# EAGLE design seven_seg_thermistor_one (EAGLE 6.0)
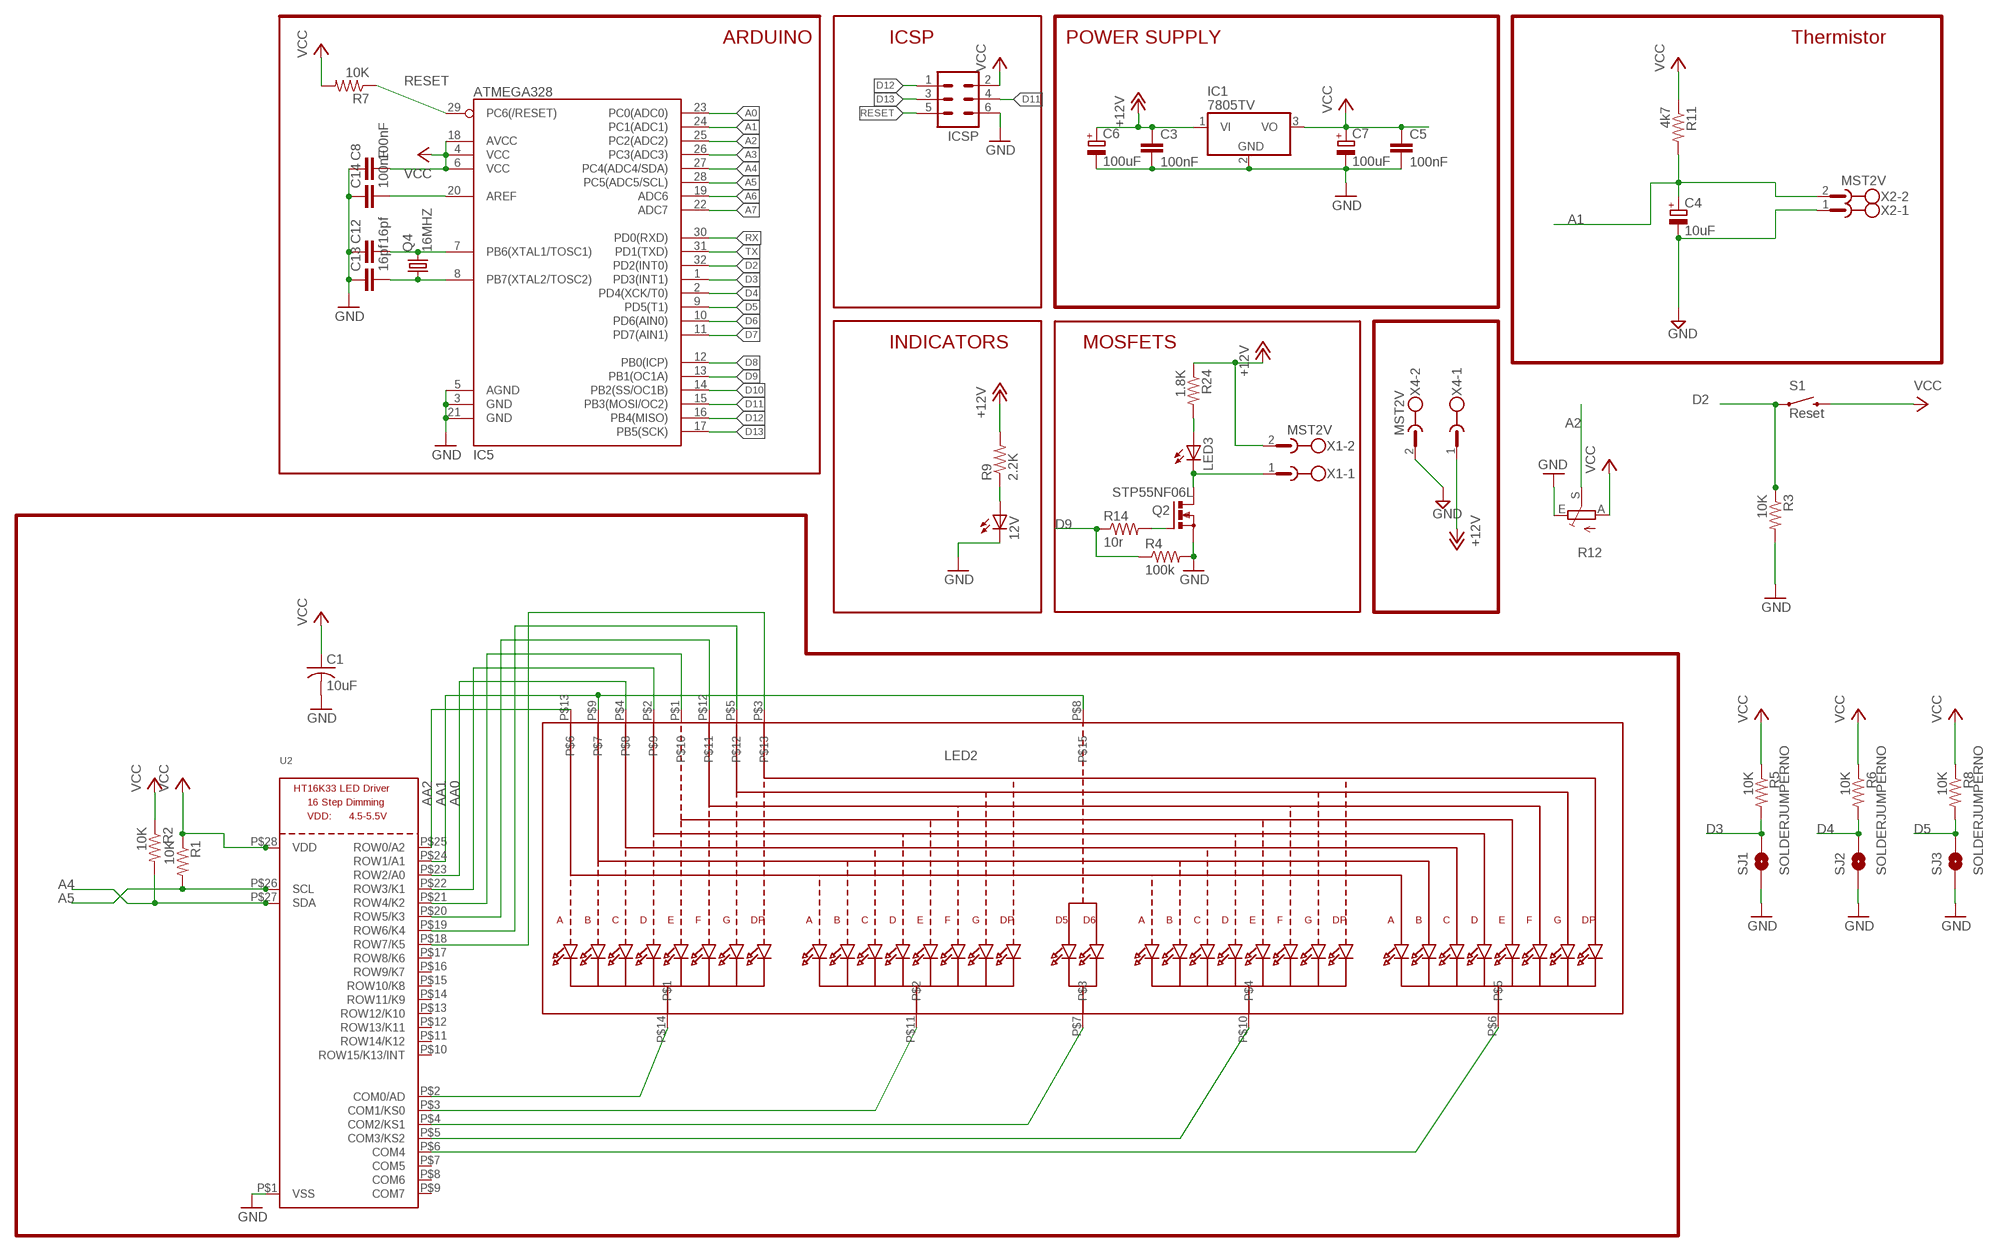
[diagram p0: schematic, sheet 1]

## Parts
12V  LED0805  [LED-0805]
C1  10uF  C-USC0805K  [C0805K]
C3  100nF  CAP0805  [0805]
C4  10uF  CPOL-EUE5-6  [E5-6]
C5  100nF  CAP0805  [0805]
C6  100uF  CPOL-EUE3.5-8  [E3,5-8]
C7  100uF  CPOL-EUE3.5-8  [E3,5-8]
C8  100nF  CAP0805  [0805]
C12  16pf  CAP0805  [0805]
C13  16pf  CAP0805  [0805]
C14  100nF  CAP0805  [0805]
IC1  7805TV  [TO220V]
IC5  ATMEGA328  ATMEGA168  [TQFP32-08]
ICSP  ML6  [ML6]
LED2  DISP_SEGMENT_4DIGIT_BL-Q56C43  [SEGMENT-BL-Q56C43]
LED3  LEDCHIP-LED0805  [CHIP-LED0805]
Q2  STP55NF06L  IRF512  [TO220BV]
Q4  16MHZ  CRYSTALHC49S  [HC49/S]
R1  10K  R-US_R0805  [R0805]
R2  10K  R-US_R0805  [R0805]
R3  10K  RESISTOR  [0805]
R4  100k  R-US_R0805  [R0805]
R5  10K  RESISTOR  [0805]
R6  10K  RESISTOR  [0805]
R7  10K  RESISTOR  [0805]
R8  10K  RESISTOR  [0805]
R9  2.2K  RESISTOR  [0805]
R11  4k7  RESISTOR  [0805]
R12  TRIM_EU-B25U  [B25U]
R14  10r  R-US_M0805  [M0805]
R24  1.8K  R-US_R0805  [R0805]
S1  Reset  SWITCH-MOMENTARY-2SMD-ALT01  [TACTILE-SWITCH-SMD-ALT01]
SJ1  SOLDERJUMPERNO  [SJ_2S-NO]
SJ2  SOLDERJUMPERNO  [SJ_2S-NO]
SJ3  SOLDERJUMPERNO  [SJ_2S-NO]
U2  HT16K33_SOP28  [SOP28_300MIL]
X1  MST2V  [MSTBV2]
X2  MST2V  [MSTBV2]
X4  MST2V  [MSTBV2]

## Nets
+12V [motors]: C3.1 C6.+ IC1.1(VI) R9.2 R24.1 X1.2 X4.1
A0: IC5.23(PC0(ADC0))
A1: C4.+ IC5.24(PC1(ADC1)) R11.2 X2.2
A2: IC5.25(PC2(ADC2)) R12.S
A3: IC5.26(PC3(ADC3))
A4: IC5.27(PC4(ADC4/SDA)) R2.2 U2.P$27(SDA)
A5: IC5.28(PC5(ADC5/SCL)) R1.2 U2.P$26(SCL)
A6: IC5.19(ADC6)
A7: IC5.22(ADC7)
AA0: LED2.P$4 U2.P$23(ROW2/A0)
AA1: LED2.P$8 LED2.P$9 U2.P$24(ROW1/A1)
AA2: LED2.P$13 U2.P$25(ROW0/A2)
D2: IC5.32(PD2(INT0)) R3.1 S1.1 S1.2
D3: IC5.1(PD3(INT1)) R5.2 SJ1.2
D4: IC5.2(PD4(XCK/T0)) R6.2 SJ2.2
D5: IC5.9(PD5(T1)) R8.2 SJ3.2
D6: IC5.10(PD6(AIN0))
D7: IC5.11(PD7(AIN1))
D8: IC5.12(PB0(ICP))
D9: IC5.13(PB1(OC1A)) R4.1 R14.1
D10: IC5.14(PB2(SS/OC1B))
D11: IC5.15(PB3(MOSI/OC2)) ICSP.4
D12: IC5.16(PB4(MISO)) ICSP.1
D13: IC5.17(PB5(SCK)) ICSP.3
GND [motors]: 12V.C C1.2 C3.2 C4.- C5.2 C6.- C7.- C8.1 C12.1 C13.1 C14.1 IC1.2(GND) IC5.3(GND) IC5.5(AGND) IC5.21(GND) ICSP.6 Q2.S R3.2 R4.2 R12.E SJ1.1 SJ2.1 SJ3.1 U2.P$1(VSS) X2.1 X4.2
N$2: LED2.P$14 U2.P$2(COM0/AD)
N$3: LED2.P$11 U2.P$3(COM1/KS0)
N$4: LED2.P$7 U2.P$4(COM2/KS1)
N$5: LED2.P$10 U2.P$5(COM3/KS2)
N$6: LED2.P$6 U2.P$6(COM4)
N$7 [motors]: LED3.C Q2.D X1.1
N$10: LED2.P$2 U2.P$22(ROW3/K1)
N$11: LED2.P$1 U2.P$21(ROW4/K2)
N$12: LED2.P$12 U2.P$20(ROW5/K3)
N$13: LED2.P$5 U2.P$19(ROW6/K4)
N$16: LED2.P$3 U2.P$18(ROW7/K5)
N$20: C14.2 IC5.20(AREF)
N$26: 12V.A R9.1
N$31: C12.2 IC5.7(PB6(XTAL1/TOSC1)) Q4.2
N$32: C13.2 IC5.8(PB7(XTAL2/TOSC2)) Q4.1
N$45: LED3.A R24.2
N$47: Q2.G R14.2
RESET: IC5.29(PC6(/RESET)) ICSP.5 R7.1
RX: IC5.30(PD0(RXD))
TX: IC5.31(PD1(TXD))
VCC: C1.1 C5.1 C7.+ C8.2 IC1.3(VO) IC5.4(VCC) IC5.6(VCC) IC5.18(AVCC) ICSP.2 R1.1 R2.1 R5.1 R6.1 R7.2 R8.1 R11.1 R12.A S1.3 S1.4 U2.P$28(VDD)
Unconnected: U2.P$7(COM5) U2.P$8(COM6) U2.P$9(COM7) U2.P$10(ROW15/K13/INT) U2.P$11(ROW14/K12) U2.P$12(ROW13/K11) U2.P$13(ROW12/K10) U2.P$14(ROW11/K9) U2.P$15(ROW10/K8) U2.P$16(ROW9/K7) U2.P$17(ROW8/K6)

## Notes on the sheet
- ARDUINO | ICSP | POWER SUPPLY | Thermistor
- INDICATORS | MOSFETS

## Library data of the parts
12V = SparkFun:LED: LEDs Standard schematic elements and footprints for 5mm, 3mm, 1206, and 0603 sized LEDs. 5mm - Spark Fun Electronics SKU : COM-00529 (and others)
C1 = adafruit:C-US: CAPACITOR, American symbol
C3 C5 C8 C12-C14 = SparkFun:CAP: Capacitor Standard 0603 ceramic capacitor, and 0.1" leaded capacitor.
C4 C6 C7 = rcl:CPOL-EU: POLARIZED CAPACITOR, European symbol
IC1 = linear:78*: Positive VOLTAGE REGULATOR Source: http://cache.national.com/ds/LM/LM78L05.pdf http://www.fairchildsemi.com/ds/LM/LM7805.pdf
IC5 = SparkFun:ATMEGA168
ICSP = con-harting-ml:ML6: HARTING
LED2 = microbuilder:DISP_SEGMENT_4DIGIT_BL-Q56C43
LED3 = led:LED: LED OSRAM: - CHIPLED LG R971, LG N971, LY N971, LG Q971, LY Q971, LO R971, LY R971 LH N974, LH R974 LS Q976, LO Q976, LY Q976 LO Q996 - Hyper CHIPLED LW Q18S LB Q993, LB Q99A, LB R99A - SideLED LS A670, LO A670, LY A670, LG A670, LP A670 LB A673, LV A673, LT A673, LW A673 LH A674 LY A675 LS A676, LA A676, LO A676, LY A676, LW A676 LS A679, LY A679, LG A679 - Hyper Micro SIDELED® LS Y876, LA Y876, LO Y876, LY Y876 LT Y87S - SmartLED LW L88C, LW L88S LB L89C, LB L89S, LG L890 LS L89K, LO L89K, LY L89K LS L896, LA L896, LO L896, LY L896 - TOPLED LS T670, LO T670, LY T670, LG T670, LP T670 LSG T670, LSP T670, LSY T670, LOP T670, LYG T670 LG T671, LOG T671, LSG T671 LB T673, LV T673, LT T673, LW T673 LH T674 LS T676, LA T676, LO T676, LY T676, LB T676, LH T676, LSB T676, LW T676 LB T67C, LV T67C, LT T67C, LS T67K, LO T67K, LY T67K, LW E67C LS E67B, LA E67B, LO E67B, LY E67B, LB E67C, LV E67C, LT E67C LW T67C LS T679, LY T679, LG T679 LS T770, LO T770, LY T770, LG T770, LP T770 LB T773, LV T773, LT T773, LW T773 LH T774 LS E675, LA E675, LY E675, LS T675 LS T776, LA T776, LO T776, LY T776, LB T776 LHGB T686 LT T68C, LB T68C - Hyper Mini TOPLED® LB M676 - Mini TOPLED Santana® LG M470 LS M47K, LO M47K, LY M47K Source: http://www.osram.convergy.de LUXEON: - LUMILED® LXK2-PW12-R00, LXK2-PW12-S00, LXK2-PW14-U00, LXK2-PW14-V00 LXK2-PM12-R00, LXK2-PM12-S00, LXK2-PM14-U00 LXK2-PE12-Q00, LXK2-PE12-R00, LXK2-PE12-S00, LXK2-PE14-T00, LXK2-PE14-U00 LXK2-PB12-K00, LXK2-PB12-L00, LXK2-PB12-M00, LXK2-PB14-N00, LXK2-PB14-P00, LXK2-PB14-Q00 LXK2-PR12-L00, LXK2-PR12-M00, LXK2-PR14-Q00, LXK2-PR14-R00 LXK2-PD12-Q00, LXK2-PD12-R00, LXK2-PD12-S00 LXK2-PH12-R00, LXK2-PH12-S00 LXK2-PL12-P00, LXK2-PL12-Q00, LXK2-PL12-R00 Source: www.luxeon.com KINGBRIGHT: KA-3528ASYC Source: www.kingbright.com
Q2 = transistor-power:IRF512: N-CHANNEL MOS FET
Q4 = crystal:CRYSTAL: CRYSTAL
R1 R2 R4 R24 = adafruit:R-US_: RESISTOR, American symbol
R3 R5-R9 R11 = SparkFun:RESISTOR: Resistor Basic schematic elements and footprints for 0603, 1206, and PTH 1/10th watt (small) resistors.
R12 = pot:TRIM_EU-: POTENTIOMETER
R14 = resistor:R-US_: RESISTOR, American symbol
S1 = Testing:SWITCH-MOMENTARY-2: Various NO switches- pushbuttons, reed, etc
SJ1-SJ3 = SparkFun-Retired:SOLDERJUMPER: Solder Jumper Standard SMD solder jumper. Used to automate production. Two varients : Normally Open and Normally Closed are the same, but have different paste layers. NC will have a large amount of paste and should jumper during reflow.
U2 = microbuilder:HT16K33_SOP28
X1 X2 X4 = con-phoenix-508:MST2V: PHOENIX

## Net classes
1 vcc: width 0.254 mm
2 motors: width 1.016 mm

## Board
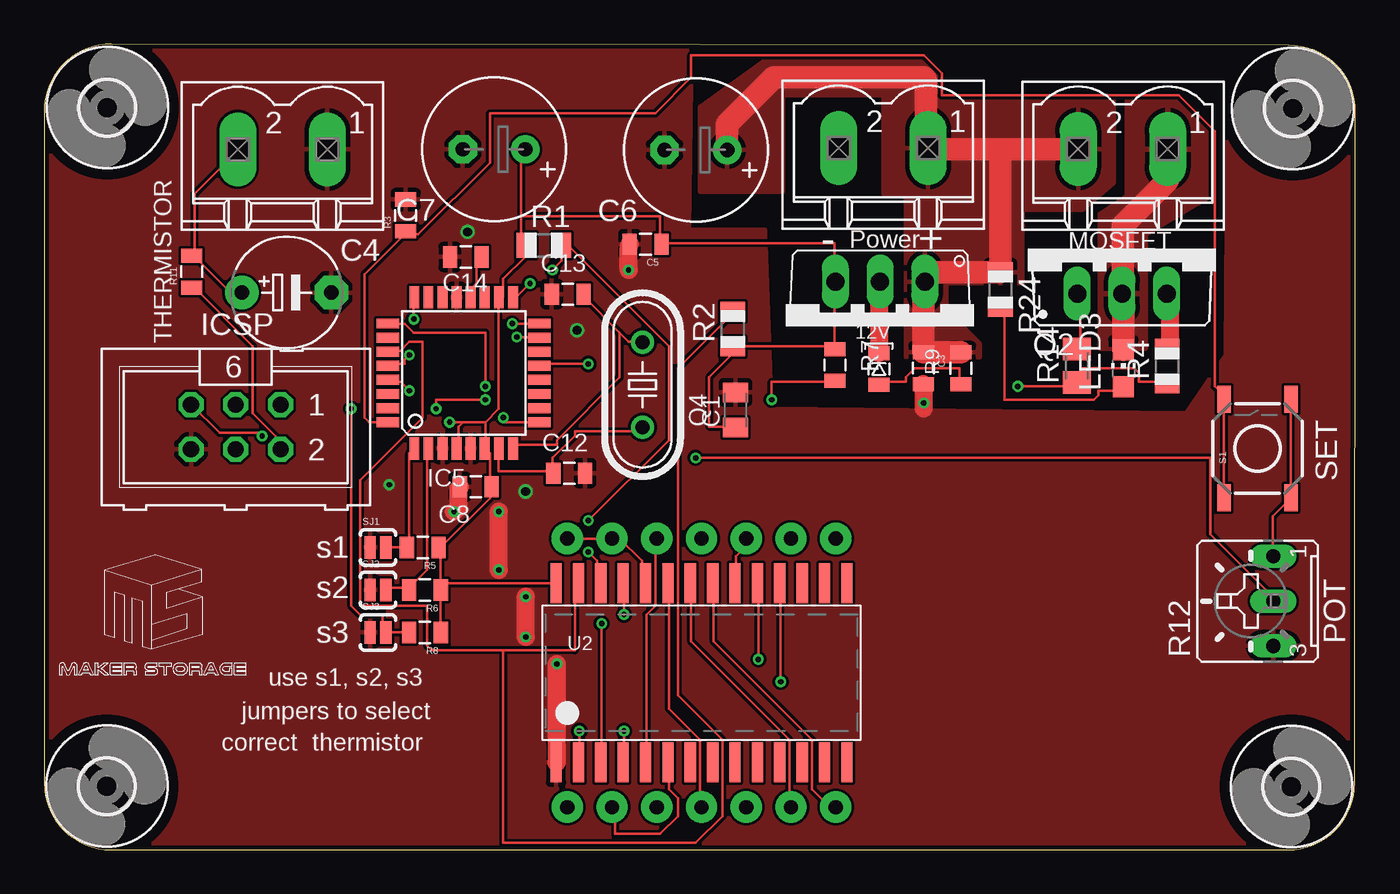
[diagram p1: board, top side]
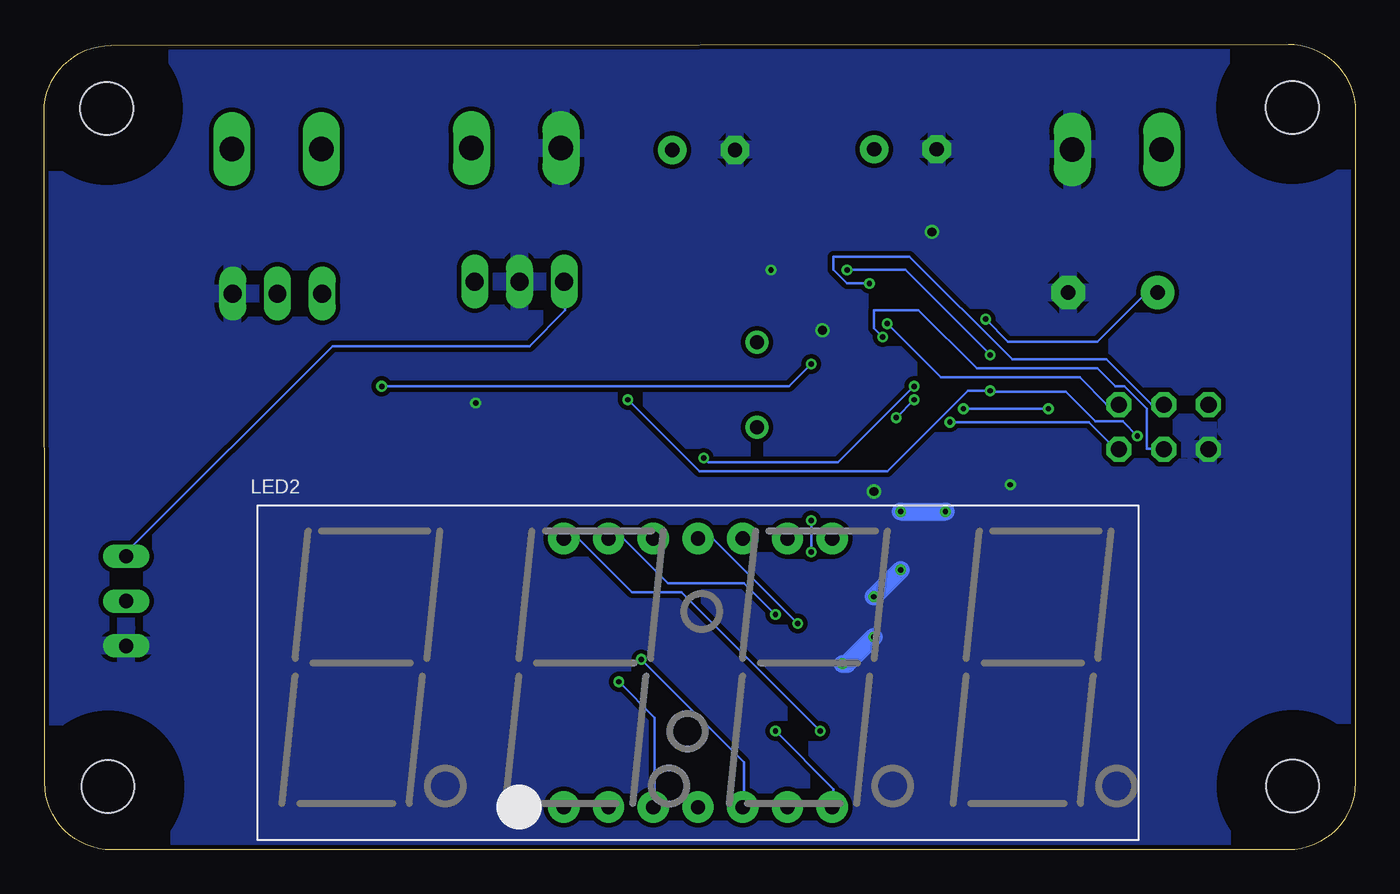
[diagram p2: board, bottom side, seen from below]

Size 74.45 x 45.73 mm. Coordinates in mm from the lower left corner, seen from the top.
Outline: 0,41.92 0.01,3.82 arc90 3.82,0 70.6,0 arc90 74.41,3.81 74.45,41.85 arc90 70.64,45.66 3.81,45.73 arc90 0,41.92
Copper layers (1*16): Top 0.035mm / dielectric 1.5mm / Bottom 0.035mm
Design rules: minimum track width 6mil, minimum drill 12mil, track to track 6mil, track to pad 6mil, pad to pad 6mil, via to via 6mil, smd to smd 0mil, copper to edge 10mil, drill to drill 10mil, minimum pad ring 10mil, minimum via ring 6mil, stop-mask expansion 2mil, vias tented up to drill 100mil, thermal gap 10mil

### Footprints (pad centres in the part's own frame; a part is rotated, then mirrored left to right if it is on the bottom)
LED-0805 = smd 1.2 x 0.8: A 0,-0.9; C 0,0.9
C0805K = smd 1.1 x 1.4: 1 -1,0; 2 1,0
0805 = smd 0.8 x 1.2: 1 -0.9,0; 2 0.9,0
E5-6 = drill 0.813 pad 1.905: + -2.54,0 | drill 0.813 pad 1.905 octagon: - 2.54,0
E3,5-8 = drill 0.813 pad 1.6: + -1.778,0 | drill 0.813 pad 1.6 octagon: - 1.778,0
TO220V = drill 1.016 long: 1 -2.54,-2.54; 2 0,-2.54; 3 2.54,-2.54
TQFP32-08 = smd 1.27 x 0.559: 1 -4.293,2.8; 2 -4.293,2; 3 -4.293,1.2; 4 -4.293,0.4; 5 -4.293,-0.4; 6 -4.293,-1.2; 7 -4.293,-2; 8 -4.293,-2.8; 17 4.293,-2.8; 18 4.293,-2; 19 4.293,-1.2; 20 4.293,-0.4; 21 4.293,0.4; 22 4.293,1.2; 23 4.293,2; 24 4.293,2.8 | smd 0.559 x 1.27: 9 -2.8,-4.293; 10 -2,-4.293; 11 -1.2,-4.293; 12 -0.4,-4.293; 13 0.4,-4.293; 14 1.2,-4.293; 15 2,-4.293; 16 2.8,-4.293; 25 2.8,4.293; 26 2,4.293; 27 1.2,4.293; 28 0.4,4.293; 29 -0.4,4.293; 30 -1.2,4.293; 31 -2,4.293; 32 -2.8,4.293
ML6 = drill 0.914 octagon: 1 -2.54,-1.27; 2 -2.54,1.27; 3 0,-1.27; 4 0,1.27; 5 2.54,-1.27; 6 2.54,1.27
SEGMENT-BL-Q56C43 = drill 0.8 pad 1.778: P$1 -7.62,-7.62; P$2 -5.08,-7.62; P$3 -2.54,-7.62; P$4 0,-7.62; P$5 2.54,-7.62; P$6 5.08,-7.62; P$7 7.62,-7.62; P$8 7.62,7.62; P$9 5.08,7.62; P$10 2.54,7.62; P$11 0,7.62; P$12 -2.54,7.62; P$13 -5.08,7.62; P$14 -7.62,7.62
CHIP-LED0805 = smd 1.2 x 1.2: A 0,-1.05; C 0,1.05
TO220BV = drill 1.016 long: D 0,-2.54; G -2.54,-2.54; S 2.54,-2.54
HC49/S = drill 0.813: 1 -2.413,0; 2 2.413,0
R0805 = smd 1.1 x 1.4: 1 -1,0; 2 1,0
B25U = drill 0.813 long: A 2.54,-0.889; E -2.54,-0.889; S 0,-0.889
M0805 = smd 1.3 x 1.6: 1 -0.95,0; 2 0.95,0
TACTILE-SWITCH-SMD-ALT01 = smd 1.524 x 0.762: 1 -2.794,1.905; 2 2.794,1.905; 3 -2.794,-1.905; 4 2.794,-1.905
SJ_2S-NO = smd 0.635 x 1.27: 1 -0.45,0; 2 0.45,0
SOP28_300MIL = smd 0.635 x 2.286: P$1 -8.255,-5.08; P$2 -6.985,-5.08; P$3 -5.715,-5.08; P$4 -4.445,-5.08; P$5 -3.175,-5.08; P$6 -1.905,-5.08; P$7 -0.635,-5.08; P$8 0.635,-5.08; P$9 1.905,-5.08; P$10 3.175,-5.08; P$11 4.445,-5.08; P$12 5.715,-5.08; P$13 6.985,-5.08; P$14 8.255,-5.08; P$15 8.255,5.08; P$16 6.985,5.08; P$17 5.715,5.08; P$18 4.445,5.08; P$19 3.175,5.08; P$20 1.905,5.08; P$21 0.635,5.08; P$22 -0.635,5.08; P$23 -1.905,5.08; P$24 -3.175,5.08; P$25 -4.445,5.08; P$26 -5.715,5.08; P$27 -6.985,5.08; P$28 -8.255,5.08
3,0 = hole 3: 0,0
MSTBV2 = drill 1.397 long: 1 -2.54,0; 2 2.54,0

### Placement (x,y rotation side)
12V  47.39,27.29 0 top
C1  39.25,24.96 90 top
C3  49.92,27.33 270 top
C4  13.77,31.63 0 top
C5  34.14,34.37 180 top
C6  37.01,39.72 180 top
C7  25.55,39.75 180 top
C8  24.5,20.6 0 top
C12  29.81,21.38 180 top
C13  29.72,31.53 0 top
C14  23.94,33.65 0 top
IC1  47.46,29.7 180 top
IC5  23.82,27.07 90 top
ICSP  10.88,23.99 180 top
LED2  37.32,10.05 0 bottom
LED3  61.27,27.32 0 top
Q2  61.2,34.1 0 top
Q4  33.98,26.4 270 top
R1  28.38,34.31 0 top
R2  39.1,29.56 90 top
R3  20.53,36.01 90 top
R4  63.76,27.45 90 top
R5  21.5,17.16 180 top
R6  21.63,14.75 180 top
R7  44.89,27.51 90 top
R8  21.63,12.33 180 top
R9  52.05,27.33 90 top
R11  8.37,32.81 90 top
R12  68.89,14.12 90 top
R14  58.63,27.47 90 top
R24  54.29,31.79 270 top
S1  68.89,22.77 90 top
SJ1  18.96,17.16 0 top
SJ2  18.96,14.75 0 top
SJ3  18.96,12.33 0 top
U2  37.32,10.05 0 top
U$1  [3,0]  3.56,3.62 0 top
U$2  [3,0]  70.89,42.07 0 top
U$3  [3,0]  3.59,42.12 0 top
U$4  [3,0]  70.81,3.59 0 top
X1  61.25,39.77 180 top
X2  13.54,39.75 180 top
X4  47.64,39.83 180 top

### Tracks (layer width: path | path; a pad name or v marks a point on that pad's centre or on a via)
+12V
  Top 1.27: X1.2 54.52,39.77 | 54.52,39.77 50.24,39.77 X4.1 50.07,39.94 50.07,43.7 49.95,43.83 41.44,43.83 38.78,41.18 C6.+ | 54.52,39.77 54.29,39.54 R24.1 50.55,32.79 IC1.1 49.92,32.16 C3.1 R9.2
  pour Top: 60.74,45.1 60.74,37.86 58.96,36.34 55.53,36.34 55.53,32.15 51.22,32.15 51.22,30.62 53.12,28.72 53.12,27.96 48.93,27.96 48.93,37.23 47.66,37.23 47.66,42.81 41.95,42.81 41.95,37.35 37.25,37.35 37.25,42.18 41.31,45.1
A1  (via drill 0.3)
  Top 0.152: C4.+ 11.08,31.64 10.58,31.64 8.54,33.67 R11.2 8.54,33.92 8.54,37.23 10.83,39.51 X2.2 | v20.99,30.11 20.99,31.13 IC5.24
  Bottom 0.152: v20.99,30.11 19.72,28.84 14.64,28.84 12.1,31.38 11.34,31.38 C4.+
A2  (via drill 0.3)
  Top 0.152: v25.05,26.3 25.05,29.35 20.99,29.35 20.48,29.86 19.72,29.86 IC5.25 | v36.99,22.24 66.2,22.24 66.2,17.92 69.76,14.37 R12.S
  Bottom 0.152: v25.05,26.3 29.37,21.99 36.74,21.99 v36.99,22.24
A4
  Top 0.152: 26.07,11.32 30.13,11.32 30.13,15.13 U2.P$27 | 26.07,11.32 22.01,11.32 21.75,11.57 21.75,13.86 17.94,13.86 17.94,20.97 21.5,24.53 21.5,28.84 20.74,28.84 20.23,28.34 19.72,28.34 IC5.27 | 26.07,11.32 26.07,0.4 36.99,0.4 38.52,1.92 38.52,6.24 35.98,8.78 35.98,27.32 39.02,30.37 R2.2
A5  (via drill 0.3)
  Top 0.152: v20.74,28.08 20.48,27.83 20.48,27.57 19.72,27.57 IC5.28 | v28.86,32.91 29.37,33.42 29.37,34.18 R1.2 29.63,34.43 35.47,28.59 35.47,23.26 v30.9,18.68 | v30.9,16.91 31.4,16.4 31.4,15.13 U2.P$26
  Bottom 0.152: v20.74,28.08 25.56,32.91 v28.86,32.91 | v30.9,18.68 v30.9,16.91
AA0
  Top 0.152: U2.P$23 35.47,15.13 35.47,8.02 37.25,6.24 37.25,2.43 LED2.P$4
AA1
  Top 0.152: U2.P$24 33.94,15.13 33.94,16.4 32.67,17.67 LED2.P$9 LED2.P$8
AA2  (via drill 0.3)
  Top 0.152: v32.93,13.35 32.93,15.13 U2.P$25
  Bottom 0.152: v32.93,13.35 34.71,15.13 39.02,15.13 41.56,17.67 LED2.P$13
D2
  Top 0.152: S1.1 66.96,20.21 66.96,25.54 S1.2 66.96,25.8 66.46,26.3 66.46,40.78 64.42,42.81 50.96,42.81 50.96,44.08 49.95,45.1 36.74,45.1 36.74,43.83 34.71,41.8 25.31,41.8 25.31,39 21.24,34.94 20.74,34.94 R3.1 20.48,34.94 18.2,32.65 18.2,24.53 18.45,24.27 19.47,24.27 IC5.32
D3
  Top 0.152: SJ1.2 R5.2 20.74,17.16 20.74,22.49 IC5.1
D4
  Top 0.152: SJ2.2 19.47,14.87 20.48,14.87 R6.2 20.74,14.87 21.75,15.89 21.75,22.75 IC5.2
D5  (via drill 0.3)
  Top 0.152: R8.2 SJ3.2 19.21,12.33 19.21,13.35 17.94,13.35 17.43,13.86 v17.43,25.03 | v26.07,24.53 26.07,24.27 IC5.9 | v25.05,25.54 22.26,25.54 v22.26,25.03
  Bottom 0.152: v25.05,25.54 v26.07,24.53 | v17.43,25.03 v22.26,25.03
D9  (via drill 0.3)
  Top 0.152: v30.9,27.57 28.36,27.57 IC5.13 | v55.28,26.3 58.58,26.3 R14.1 58.84,26.56 58.84,27.32 61.88,27.32 62.14,27.07 62.14,26.56 63.66,26.56 R4.1
  Bottom 0.152: v30.9,27.57 32.17,26.3 v55.28,26.3
D11  (via drill 0.3)
  Top 0.152: v26.83,29.1 28.1,29.1 IC5.15
  Bottom 0.152: v26.83,29.1 27.34,29.61 27.34,30.62 24.8,30.62 21.5,27.32 14.64,27.32 13.62,26.3 13.12,26.3 11.85,25.03 11.85,22.75 11.08,22.75 ICSP.4
D12  (via drill 0.3)
  Top 0.152: v26.58,29.86 IC5.16
  Bottom 0.152: v26.58,29.86 23.53,26.81 15.66,26.81 14.13,25.29 13.62,25.29 ICSP.1
D13  (via drill 0.3)
  Top 0.152: v27.59,32.15 26.83,31.38 IC5.17
  Bottom 0.152: v27.59,32.15 28.86,32.15 29.63,32.91 29.63,33.67 25.31,33.67 19.47,27.83 14.13,27.83 11.59,25.29 11.08,25.29 ICSP.3
GND  (via drill 0.3, 0.5)
  Top 1.016: 49.95,25.03 v49.95,25.36 49.95,26.3 C3.2 | 12V.C 47.41,28.34 47.41,32.15 IC1.2 | R4.2 63.92,28.59 63.92,31.38 Q2.S | v23.28,19.19 23.53,19.45 23.53,20.46 C8.1 | v25.82,15.89 v25.82,19.19 | v27.34,12.08 v27.34,14.37 | v29.12,10.56 29.12,4.97 U2.P$1 | v33.18,32.91 33.18,34.18 C5.2
  Bottom 1.016: v25.82,19.19 v23.28,19.19 | v27.34,14.37 v25.82,15.89 | v27.34,12.08 28.86,10.56 v29.12,10.56
  other vias: 24.04,35.07 30.26,29.48 27.34,20.34 19.59,20.72
  pour Bottom (isolate 0.254): -6.76,66.13 79.74,66.23 78.51,-12.92 -6.83,-13.32
  pour Top: 36.61,35.19 36.87,53.86 -1.74,53.48 -2,-4.68 76.49,-4.68 76.62,47.01 67.22,47.01 67.09,28.08 64.81,24.78 41.31,25.03 40.93,35.19
N$2  (via drill 0.3)
  Top 0.152: v30.39,6.75 30.39,4.97 U2.P$2
  Bottom 0.152: v30.39,6.75 38.26,14.62 41.06,14.62 44.1,17.67 LED2.P$14
N$3  (via drill 0.3)
  Top 0.152: v31.66,12.84 31.66,4.97 U2.P$3
  Bottom 0.152: v31.66,12.84 36.48,17.67 LED2.P$11
N$4  (via drill 0.3)
  Top 0.152: v32.93,6.75 32.93,4.97 U2.P$4
  Bottom 0.152: v32.93,6.75 29.63,3.44 29.63,2.43 LED2.P$7
N$5
  Top 0.152: U2.P$5 34.2,4.97 34.2,13.35 34.71,13.86 34.71,17.67 LED2.P$10
N$6
  Top 0.152: U2.P$6 35.47,4.97 35.47,3.44 35.98,2.94 35.98,1.92 34.96,0.9 32.42,0.9 32.42,2.43 LED2.P$6
N$7
  Top 1.27: X1.1 63.79,37.99 61.25,35.45 61.25,31.61 Q2.D 61.27,31.49 LED3.C
  pour Top: 62.52,28.46 59.98,28.46 59.98,36.08 61.5,37.1 61.5,45.1 65.95,45.1 65.95,36.97 62.52,34.94
N$10
  Top 0.152: U2.P$22 36.74,15.13 36.74,11.83 42.33,6.24 42.33,2.43 LED2.P$2
N$11
  Top 0.152: LED2.P$1 44.61,2.43 43.6,3.44 43.6,6.24 38.01,11.83 38.01,15.13 U2.P$21
N$12
  Top 0.152: U2.P$20 39.28,15.13 39.28,16.65 40.04,17.41 40.04,17.67 LED2.P$12
N$13  (via drill 0.3)
  Top 0.152: v40.55,10.81 40.55,15.13 U2.P$19
  Bottom 0.152: v40.55,10.81 34.71,4.97 34.71,2.43 LED2.P$5
N$16  (via drill 0.3)
  Top 0.152: v41.82,9.54 41.82,15.13 U2.P$18
  Bottom 0.152: v41.82,9.54 39.79,7.51 39.79,2.43 LED2.P$3
N$20
  Top 0.152: C14.2 24.8,33.42 24.55,33.16 24.55,32.15 24.29,31.89 24.29,31.38 IC5.20
N$26
  Top 0.152: 12V.A 47.41,26.56 48.93,26.56 48.93,26.81 49.44,27.32 51.98,27.32 51.98,26.56 R9.1
N$31
  Top 0.152: 28.86,21.48 25.82,21.48 25.82,22.75 IC5.7 | 28.86,21.48 28.86,22.24 30.13,23.51 30.13,23.76 33.94,23.76 Q4.2 | 28.86,21.48 C12.2
N$32
  Top 0.152: 32.67,29.35 33.18,28.84 33.94,28.84 Q4.1 | 32.67,29.35 30.64,31.38 C13.2 | 32.67,29.35 32.67,26.81 29.12,23.26 29.12,23 26.83,23 IC5.8
N$45
  Top 0.152: LED3.A 61.12,26.05 59.85,26.05 59.85,25.8 59.6,25.54 54.52,25.54 54.52,30.62 R24.2
N$47
  Top 0.152: R14.2 58.84,28.59 58.84,31.38 Q2.G
RESET  (via drill 0.3)
  Top 0.152: v41.31,25.54 41.31,26.56 44.87,26.56 R7.1 | v20.74,26.05 20.23,26.56 19.72,26.56 IC5.29 | v12.38,23.49 12.38,23.66 9.97,23.66 8.37,25.26 ICSP.5
  Bottom 0.152: v41.31,25.54 37.25,21.48 26.58,21.48 22.01,26.05 v20.74,26.05 20.69,26 16.44,26 14.77,24.32 13.22,24.32 v12.38,23.49
VCC  (via drill 0.3)
  Top 0.152: R11.1 8.54,31.89 11.85,28.59 11.85,24.78 13.37,23.26 13.37,22.75 ICSP.2 | 27.09,35.96 27.09,39.51 C7.+ | 27.09,35.96 27.09,34.69 27.34,34.43 R1.1 27.34,34.18 27.34,33.67 26.07,32.4 26.07,31.38 IC5.18 25.82,31.13 25.82,25.03 25.05,24.27 | 23.78,24.27 23.53,24.02 23.53,23 IC5.4 | 25.05,24.27 23.78,24.27 | 25.05,24.27 25.05,23 IC5.6 25.05,22.75 25.31,22.49 25.31,20.72 C8.2 25.31,20.46 25.31,19.95 22.51,17.16 | 23.78,24.27 v23.02,24.27 | R12.A 69.76,16.91 69.76,18.94 S1.3 70.77,20.21 70.77,25.54 S1.4 | 44.87,28.59 44.87,32.15 IC1.3 44.87,32.4 44.87,34.43 35.21,34.43 C5.1 34.96,34.43 34.96,35.96 27.09,35.96 | 44.87,28.59 39.28,28.59 R2.1 39.02,28.34 39.02,28.08 37.75,26.81 37.75,24.02 39.02,24.02 C1.1 | 44.87,28.59 R7.2 | R8.1 22.51,14.62 R6.1 | 22.51,15.13 22.51,14.87 R6.1 | 22.51,15.13 22.51,17.16 | 22.51,15.13 U2.P$28 | 22.51,15.13 R6.1 | 22.51,17.16 R5.1
  Bottom 0.152: v23.02,24.27 15.15,24.27 13.62,22.75 ICSP.2 | R12.A 69.76,16.91 58.07,28.59 46.9,28.59 44.87,30.62 44.87,32.15 IC1.3

### Text on the board
tPlace: THERMISTOR | Power | MOSFET | - | + | SET | s1 | s2 | POT | s3 | use s1, s2, s3 | jumpers to select | correct thermistor